# EAGLE schematic demeter (EAGLE 6.1)
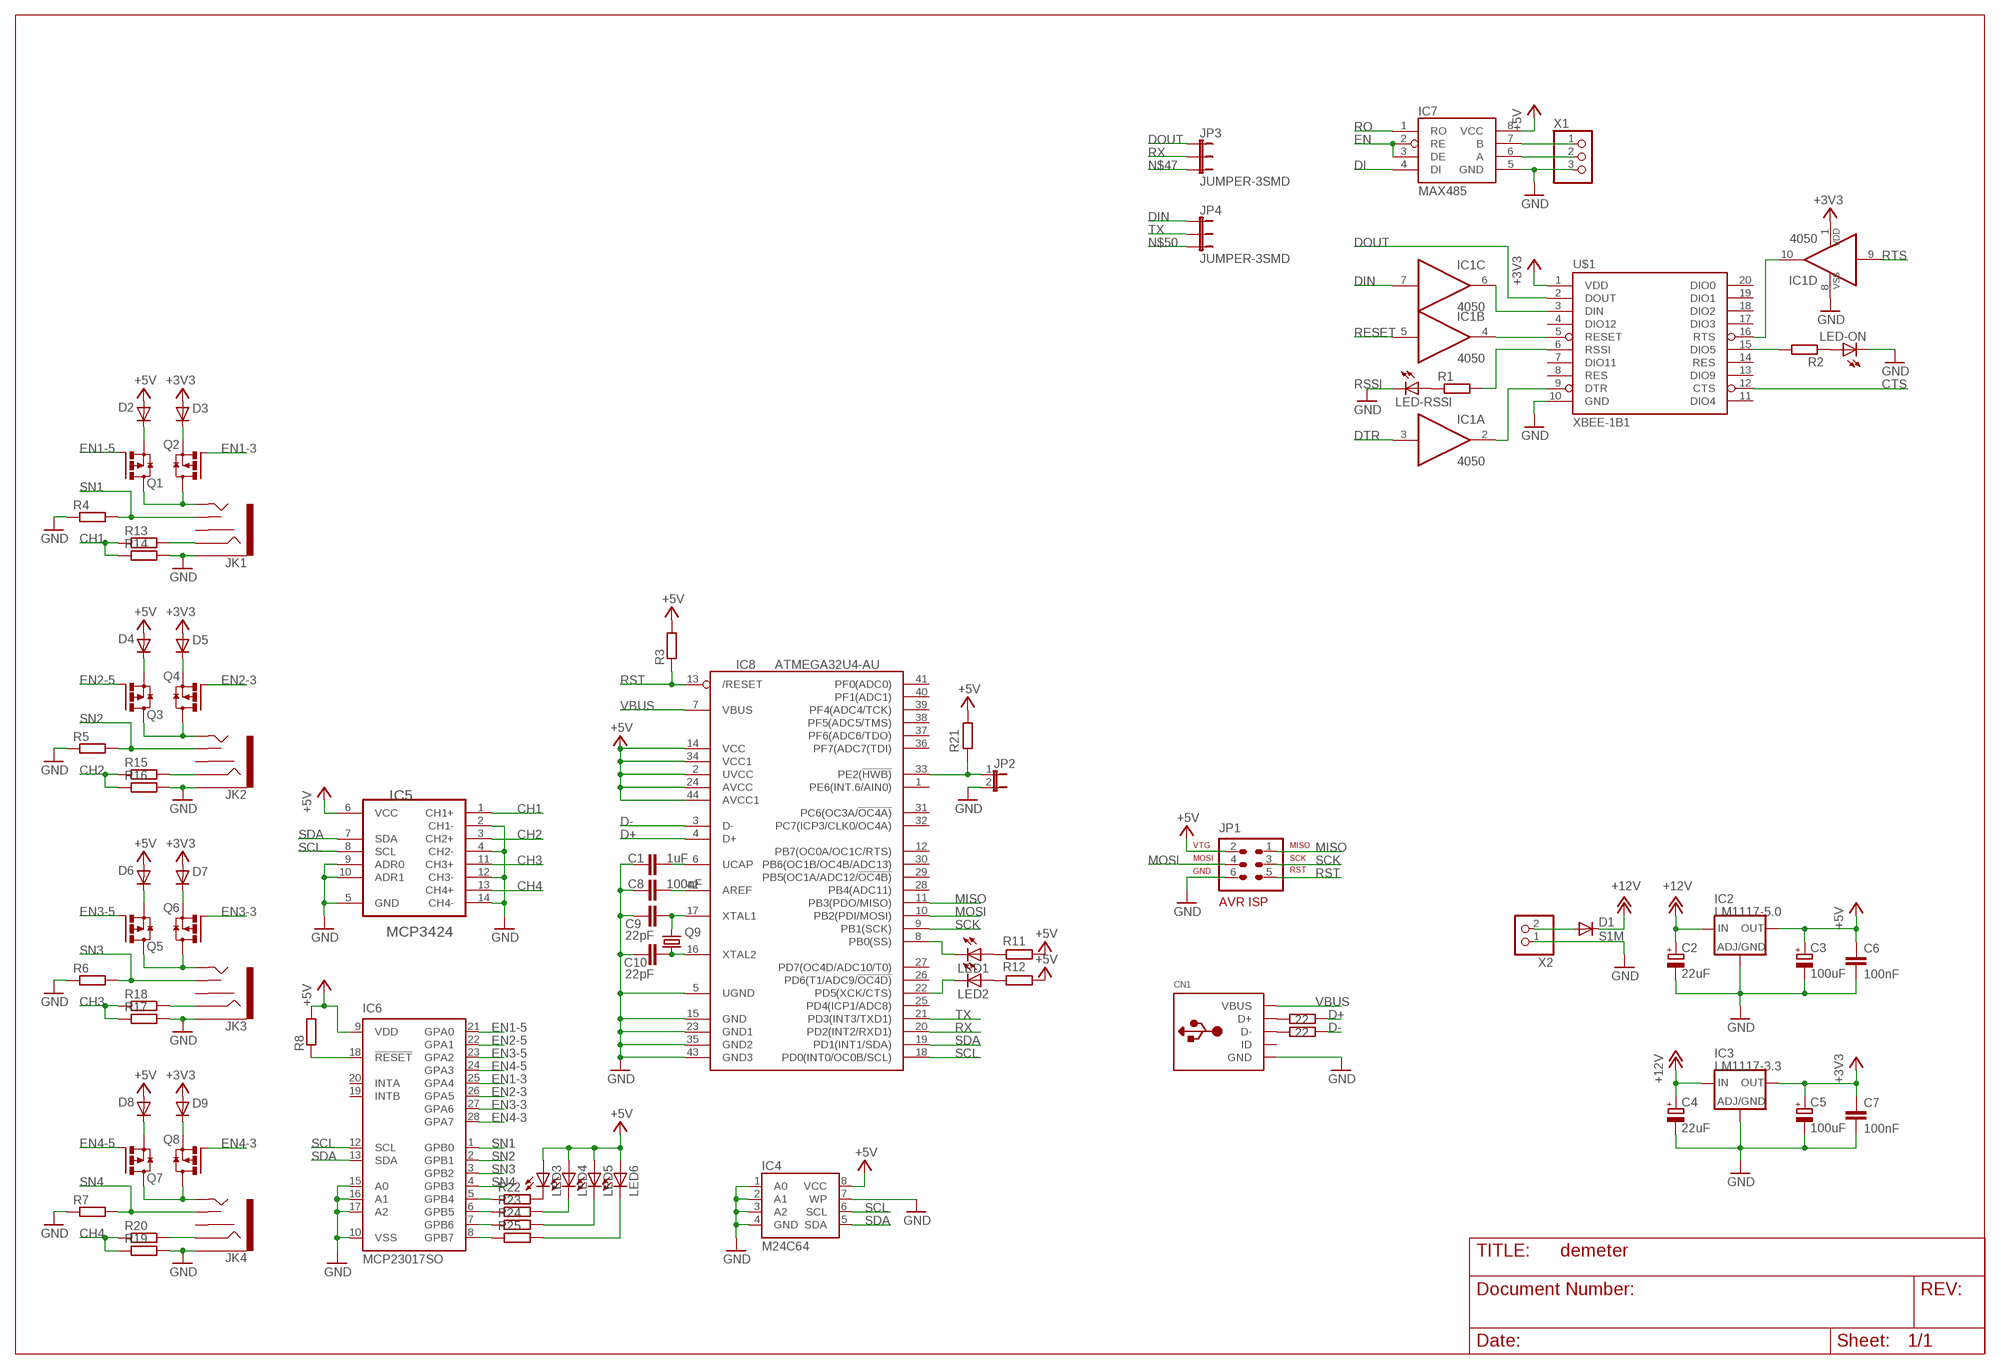
[diagram p0: schematic, sheet 1]

## Parts
C1  1uF  C-EUC0805K  [C0805K]
C2  22uF  CPOL-EUPD  [PANASONIC_D]
C3  100uF  CPOL-EUPD  [PANASONIC_D]
C4  22uF  CPOL-EUPD  [PANASONIC_D]
C5  100uF  CPOL-EUPD  [PANASONIC_D]
C6  100nF  C-EUC0805K  [C0805K]
C7  100nF  C-EUC0805K  [C0805K]
C8  100nF  C-EUC0805K  [C0805K]
C9  22pF  C-EUC0805K  [C0805K]
C10  22pF  C-EUC0805K  [C0805K]
CN1  USBMINIB  [USB-MINIB]
D1  S1M  [DO-214AC]
D2  MBR0520  [SOD123]
D3  MBR0520  [SOD123]
D4  MBR0520  [SOD123]
D5  MBR0520  [SOD123]
D6  MBR0520  [SOD123]
D7  MBR0520  [SOD123]
D8  MBR0520  [SOD123]
D9  MBR0520  [SOD123]
IC1  4050  4050D  [SO16]
IC2  LM1117-5.0  LM1117DT  [DPACK]
IC3  LM1117-3.3  LM1117DT  [DPACK]
IC4  M24C64  AT24C  [SO08]
IC5  MCP3424  [SO14]
IC6  MCP23017SO  [SO28W]
IC7  MAX485  [SO08]
IC8  ATMEGA32U4-AU  [TQFP44]
JK1  AUDIO-JACK2PTH  [AUDIO-JACK]
JK2  AUDIO-JACK2PTH  [AUDIO-JACK]
JK3  AUDIO-JACK2PTH  [AUDIO-JACK]
JK4  AUDIO-JACK2PTH  [AUDIO-JACK]
JP1  AVR-ISP-6  [AVR-ISP-6]
JP2  JUMPER-2SMD-NO  [SJ_2S-NO]
JP3  JUMPER-3SMD  [SJ_3]
JP4  JUMPER-3SMD  [SJ_3]
LED1  LED0805  [CHIP-LED0805]
LED2  LED0805  [CHIP-LED0805]
LED3  LED0805  [CHIP-LED0805]
LED4  LED0805  [CHIP-LED0805]
LED5  LED0805  [CHIP-LED0805]
LED6  LED0805  [CHIP-LED0805]
LED-ON  LED3MM  [LED3MM]
LED-RSSI  LED3MM  [LED3MM]
Q1  IRLML6402  [SOT23]
Q2  IRLML6402  [SOT23]
Q3  IRLML6402  [SOT23]
Q4  IRLML6402  [SOT23]
Q5  IRLML6402  [SOT23]
Q6  IRLML6402  [SOT23]
Q7  IRLML6402  [SOT23]
Q8  IRLML6402  [SOT23]
Q9  CRYSTALHC49UP  [HC49UP]
R1  R-EU_R0805  [R0805]
R2  R-EU_R0805  [R0805]
R3  R-EU_R0805  [R0805]
R4  R-EU_R0805  [R0805]
R5  R-EU_R0805  [R0805]
R6  R-EU_R0805  [R0805]
R7  R-EU_R0805  [R0805]
R8  R-EU_R0805  [R0805]
R9  22  R-EU_R0805  [R0805]
R10  22  R-EU_R0805  [R0805]
R11  R-EU_R0805  [R0805]
R12  R-EU_R0805  [R0805]
R13  R-EU_R0805  [R0805]
R14  R-EU_R0805  [R0805]
R15  R-EU_R0805  [R0805]
R16  R-EU_R0805  [R0805]
R17  R-EU_R0805  [R0805]
R18  R-EU_R0805  [R0805]
R19  R-EU_R0805  [R0805]
R20  R-EU_R0805  [R0805]
R21  R-EU_R0805  [R0805]
R22  R-EU_R0805  [R0805]
R23  R-EU_R0805  [R0805]
R24  R-EU_R0805  [R0805]
R25  R-EU_R0805  [R0805]
U$1  XBEE-1B1  [XBEE-1]
X1  W237-103  [W237-103]
X2  W237-102  [W237-102]

## Nets
+3V3: C5.+ C7.1 D3.A D5.A D7.A D9.A IC1.1(P:VDD) IC3.4(OUT) U$1.1(VDD)
+5V: C3.+ C6.1 D2.A D4.A D6.A D8.A IC2.4(OUT) IC4.8(VCC) IC5.6(VCC) IC6.9(VDD) IC7.8(VCC) IC8.2(UVCC) IC8.14(VCC) IC8.24(AVCC) IC8.34(VCC1) IC8.44(AVCC1) JP1.2(VTG) LED3.A LED4.A LED5.A LED6.A R3.2 R8.2 R11.1 R12.1 R21.1
+12V: C2.+ C4.+ D1.C IC2.3(IN) IC3.3(IN)
CH1: IC5.1(CH1+) R13.1 R14.1
CH2: IC5.3(CH2+) R15.1 R16.1
CH3: IC5.11(CH3+) R17.1 R18.1
CH4: IC5.13(CH4+) R19.1 R20.1
CTS: U$1.12(CTS)
D+: IC8.4(D+) R9.1
D-: IC8.3(D-) R10.1
DI: IC7.4(DI)
DIN: IC1.7(C:I) JP4.1
DOUT: JP3.1 U$1.2(DOUT)
DTR: IC1.3(A:I)
EN: IC7.2(RE) IC7.3(DE)
EN1-3: IC6.25(GPA4) Q2.1(G)
EN1-5: IC6.21(GPA0) Q1.1(G)
EN2-3: IC6.26(GPA5) Q4.1(G)
EN2-5: IC6.22(GPA1) Q3.1(G)
EN3-3: IC6.27(GPA6) Q6.1(G)
EN3-5: IC6.23(GPA2) Q5.1(G)
EN4-3: IC6.28(GPA7) Q8.1(G)
EN4-5: IC6.24(GPA3) Q7.1(G)
GND: C1.2 C2.- C3.- C4.- C5.- C6.2 C7.2 C8.2 C9.2 C10.2 CN1.GND IC1.8(P:VSS) IC2.1(ADJ) IC3.1(ADJ) IC4.1(A0) IC4.2(A1) IC4.3(A2) IC4.4(GND) IC4.7(WP) IC5.2(CH1-) IC5.4(CH2-) IC5.5(GND) IC5.9(ADR0) IC5.10(ADR1) IC5.12(CH3-) IC5.14(CH4-) IC6.10(VSS) IC6.15(A0) IC6.16(A1) IC6.17(A2) IC7.5(GND) IC8.5(UGND) IC8.15(GND) IC8.23(GND1) IC8.35(GND2) IC8.43(GND3) JK1.SLEEVE JK2.SLEEVE JK3.SLEEVE JK4.SLEEVE JP1.6(GND) JP2.2 LED-ON.K(C) LED-RSSI.K(C) R4.1 R5.1 R6.1 R7.1 R14.2 R16.2 R17.2 R19.2 U$1.10(GND) X1.3 X2.1
MISO: IC8.11(PB3(PDO/MISO)) JP1.1(MISO)
MOSI: IC8.10(PB2(PDI/MOSI)) JP1.4(MOSI)
N$1: D1.A X2.2
N$2: IC7.7(B) X1.1
N$3: IC1.6(C:O) U$1.3(DIN)
N$4: IC1.4(B:O) U$1.5(RESET)
N$5: IC7.6(A) X1.2
N$6: LED-RSSI.A R1.1
N$7: IC1.2(A:O) U$1.9(DTR)
N$8: IC1.10(D:O) U$1.16(RTS)
N$9: LED-ON.A R2.1
N$10: R2.2 U$1.15(DIO5)
N$11: IC6.18(!RESET) R8.1
N$12: JK1.TIP Q1.3(D) Q2.3(D)
N$13: D2.C Q1.2(S)
N$14: D3.C Q2.2(S)
N$15: JK2.TIP Q3.3(D) Q4.3(D)
N$16: D4.C Q3.2(S)
N$17: D5.C Q4.2(S)
N$18: JK3.TIP Q5.3(D) Q6.3(D)
N$19: D6.C Q5.2(S)
N$20: D7.C Q6.2(S)
N$21: JK4.TIP Q7.3(D) Q8.3(D)
N$22: D8.C Q7.2(S)
N$23: D9.C Q8.2(S)
N$24: C1.1 IC8.6(UCAP)
N$25: C8.1 IC8.42(AREF)
N$26: C9.1 IC8.17(XTAL1) Q9.2
N$27: C10.1 IC8.16(XTAL2) Q9.1
N$28: CN1.D+ R9.2
N$29: CN1.D- R10.2
N$30: JK1.RING R13.2
N$31: LED1.A R11.2
N$32: JK2.RING R15.2
N$33: LED2.A R12.2
N$34: JK3.RING R18.2
N$35: JK4.RING R20.2
N$36: IC8.33(PE2(!HWB)) JP2.1 R21.2
N$37: LED3.C R22.2
N$39: LED4.C R23.2
N$40: LED5.C R24.2
N$41: LED6.C R25.2
N$42: IC6.8(GPB7) R25.1
N$43: IC6.7(GPB6) R24.1
N$44: IC6.6(GPB5) R23.1
N$45: IC6.5(GPB4) R22.1
N$47: JP3.3
N$50: JP4.3
RESET: IC1.5(B:I)
RO: IC7.1(RO)
RSSI: R1.2 U$1.6(RSSI)
RST: IC8.13(/RESET) JP1.5(RST) R3.1
RTS: IC1.9(D:I)
RX: IC8.20(PD2(INT2/RXD1)) JP3.2
RXLED: IC8.8(PB0(SS)) LED1.C
SCK: IC8.9(PB1(SCK)) JP1.3(SCK)
SCL: IC4.6(SCL) IC5.8(SCL) IC6.12(SCL) IC8.18(PD0(INT0/OC0B/SCL))
SDA: IC4.5(SDA) IC5.7(SDA) IC6.13(SDA) IC8.19(PD1(INT1/SDA))
SN1: IC6.1(GPB0) JK1.TSH R4.2
SN2: IC6.2(GPB1) JK2.TSH R5.2
SN3: IC6.3(GPB2) JK3.TSH R6.2
SN4: IC6.4(GPB3) JK4.TSH R7.2
TX: IC8.21(PD3(INT3/TXD1)) JP4.2
TXLED: IC8.22(PD5(XCK/CTS)) LED2.C
VBUS: CN1.VBUS IC8.7(VBUS)
Unconnected: CN1.ID IC1.11(E:I) IC1.12(E:O) IC1.14(F:I) IC1.15(F:O) IC6.19(INTB) IC6.20(INTA) IC8.1(PE6(INT.6/AIN0)) IC8.12(PB7(OC0A/OC1C/RTS)) IC8.25(PD4(ICP1/ADC8)) IC8.26(PD6(T1/ADC9/!OC4D)) IC8.27(PD7(OC4D/ADC10/T0)) IC8.28(PB4(ADC11)) IC8.29(PB5(OC1A/ADC12/!OC4B)) IC8.30(PB6(OC1B/OC4B/ADC13)) IC8.31(PC6(OC3A/!OC4A)) IC8.32(PC7(ICP3/CLK0/OC4A)) IC8.36(PF7(ADC7(TDI)) IC8.37(PF6(ADC6/TDO)) IC8.38(PF5(ADC5/TMS)) IC8.39(PF4(ADC4/TCK)) IC8.40(PF1(ADC1)) IC8.41(PF0(ADC0)) JK1.RSH JK2.RSH JK3.RSH JK4.RSH U$1.4(DIO12) U$1.7(DIO11) U$1.8(RES) U$1.11(DIO4) U$1.13(DIO9) U$1.14(RES) U$1.17(DIO3) U$1.18(DIO2) U$1.19(DIO1) U$1.20(DIO0)

## Library data of the parts
C1 C6-C10 = mark_2:C-EU: CAPACITOR, European symbol
C2-C5 = mark_2:CPOL-EU: POLARIZED CAPACITOR, European symbol
CN1 = mark_2:USB: USB Connectors USBMINIB - Surface Mount Female Mini-B USB Connector 4UConnector: 06564 By microbuilder.eu Thru-hole RA Female Mini-B USB Connector 4UConnector: 18732 By ladyada.net
D1 = mark_2:S1M
D2-D9 = mark_2:MBR0520: SCHOTTKY BARRIER RECTIFIER Source: http://onsemi.com .. MBR0520LT1-D.pdf
IC1 = mark_2:4050: Hex non-inverting BUFFER
IC2 IC3 = mark_2:LM1117: Low drop fixed and adjustable positive voltage regulators 1 A Source: http://www.st.com/stonline/products/literature/ds/7194/ld1117axx.pdf
IC4 = mark_2:AT24C*: 2-wire serial EEPROM
IC5 = mark_2:MCP3424: Analog-to-Digital Converter; MPN: MCP3424-E/SL; OC_FARNELL: 1630424; OC_NEWARK: 54M4871; PACKAGE: SOIC-14; SUPPLIER: Microchip
IC6 = mark_2:MCP23017: http://ww1.microchip.com/downloads/en/DeviceDoc/21952a.pdf Source: http://ww1.microchip.com/downloads/en/DeviceDoc/21952a.pdf; MF: MICROCHIP; MPN: MCP23017-E/SO; OC_FARNELL: 1332087; OC_NEWARK: 31K2958
IC7 = mark_2:MAX485
IC8 = mark_2:ATMEGA32U4: http://www.ladyada.net/library/eagle
JK1-JK4 = mark_2:AUDIO-JACK2
JP1 = mark_2:AVR-ISP-6: AVR ISP-6 Serial Programming Header
JP2 = mark_2:JUMPER-2: Jumper Basic 0.1" spaced jumper. Use with breakaway headers.
JP3 JP4 = mark_2:JUMPER-3
LED1-LED6 = mark_2:LED
LED-ON LED-RSSI = mark_1:LED
Q1-Q8 = mark_2:IRLML6402: Single P-Channe MOSFET
Q9 = mark_2:CRYSTAL: CRYSTAL
R1-R25 = mark_2:R-EU_: RESISTOR, European symbol
U$1 = mark_2:XBEE-1
X1 = mark_2:W237-103: WAGO SCREW CLAMP
X2 = mark_2:W237-102: WAGO SCREW CLAMP